# EAGLE design RC_module (EAGLE 7.2.0)
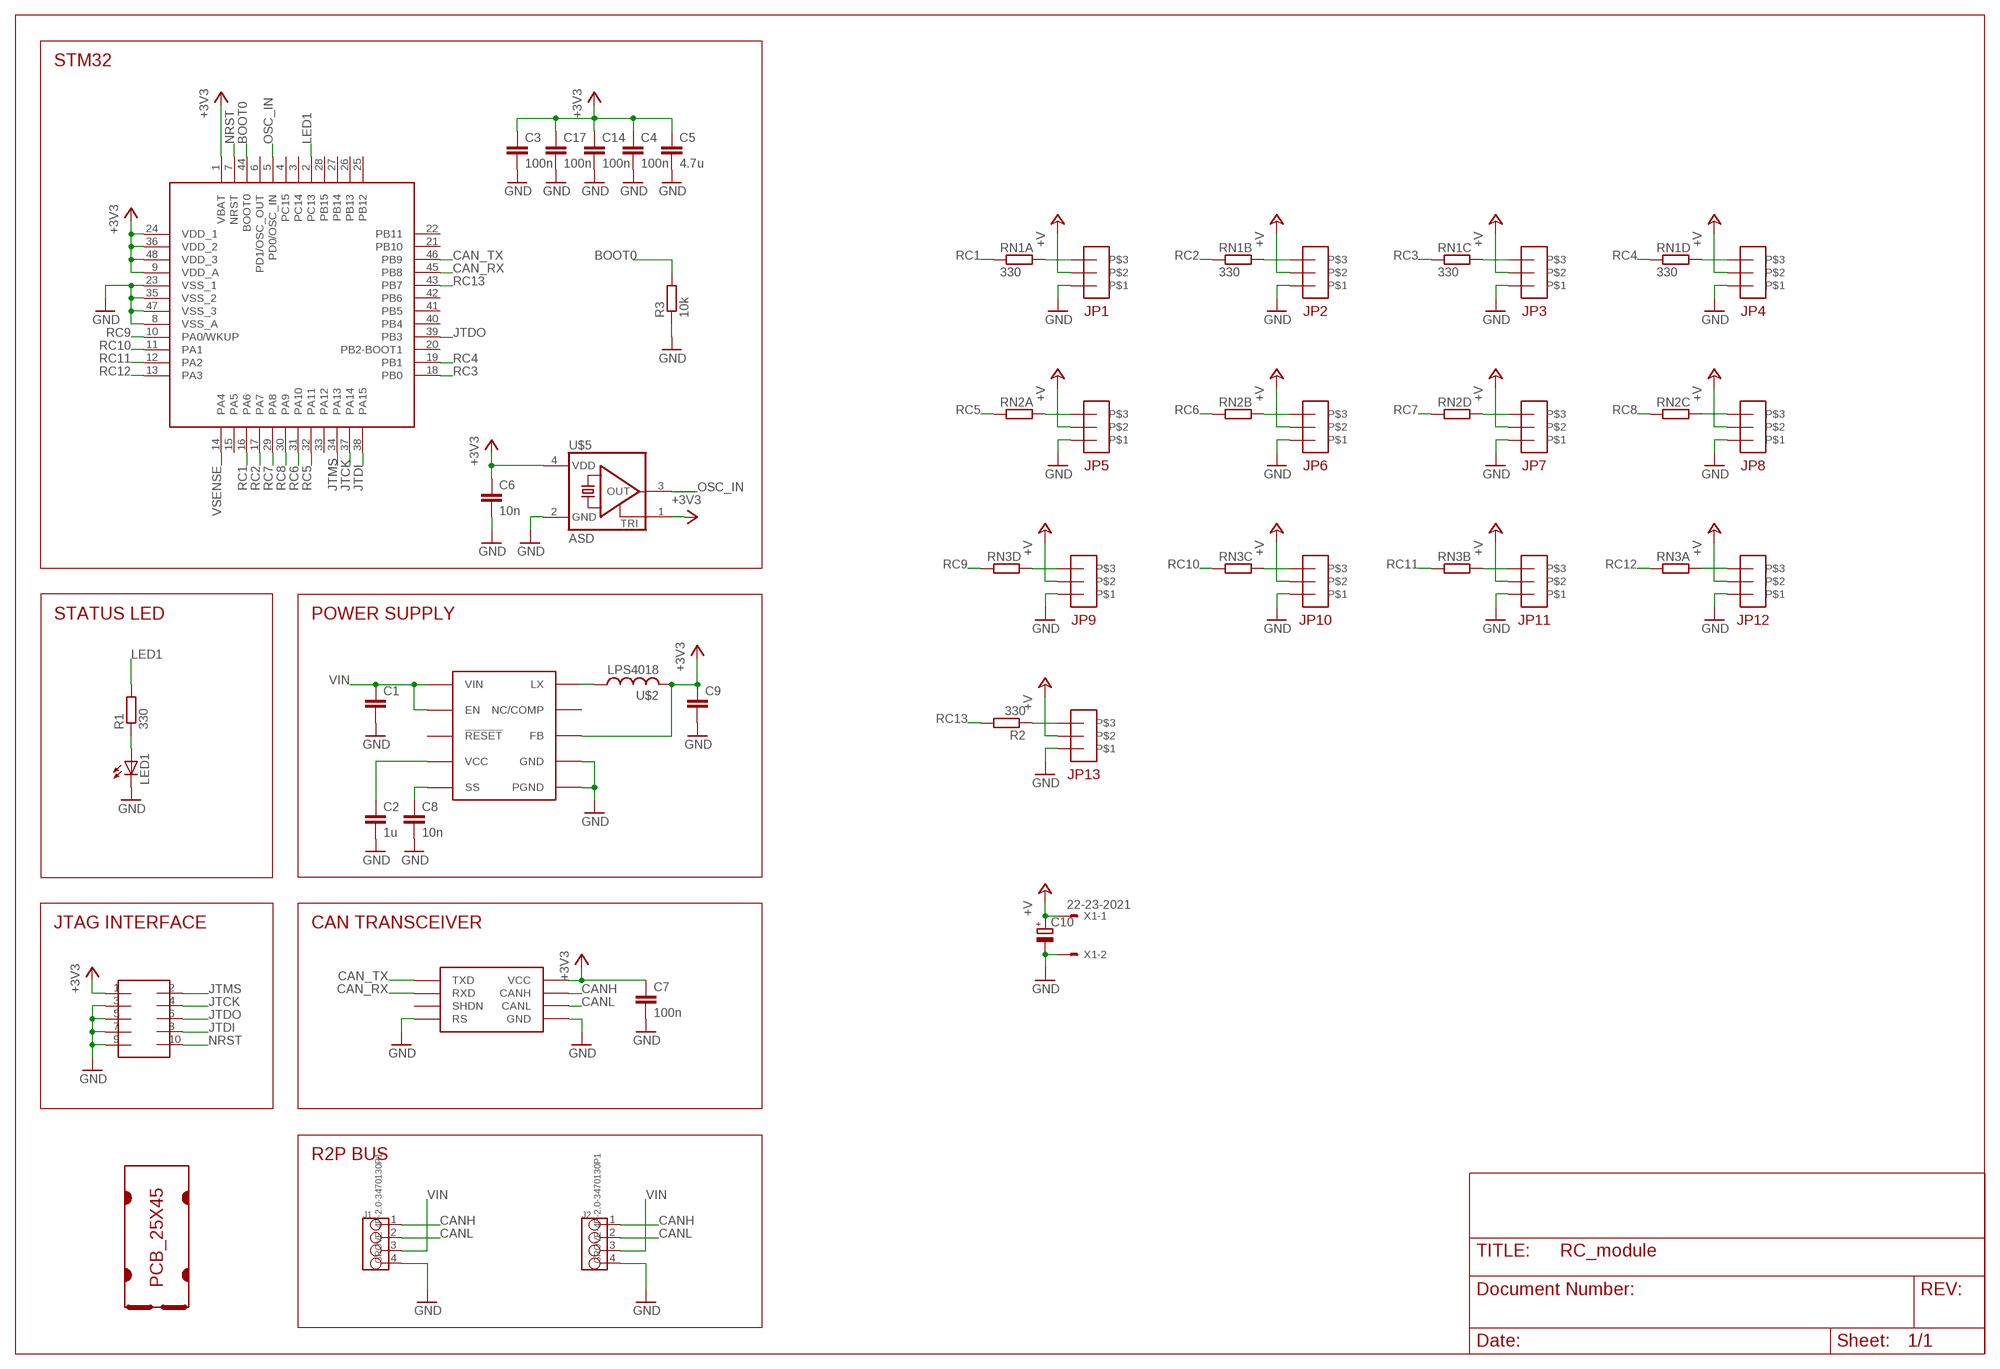
[diagram p0: schematic, sheet 1]

## Parts
C1  C-EUC1206  [C1206]
C2  1u  C-EUC0603  [C0603]
C3  100n  C-EUC0603  [C0603]
C4  100n  C-EUC0603  [C0603]
C5  4.7u  C-EUC0805  [C0805]
C6  10n  C-EUC0603  [C0603]
C7  100n  C-EUC0603  [C0603]
C8  10n  C-EUC0603  [C0603]
C9  C-EUC0805  [C0805]
C10  CPOL-EUB/3528-21R  [B/3528-21R]
C14  100n  C-EUC0603  [C0603]
C17  100n  C-EUC0603  [C0603]
J1  GROVE-4P-2.0-3470130P1  [4P-2.0]
J2  GROVE-4P-2.0-3470130P1  [4P-2.0]
JP1  PINHD-3  [1X03]
JP2  PINHD-3  [1X03]
JP3  PINHD-3  [1X03]
JP4  PINHD-3  [1X03]
JP5  PINHD-3  [1X03]
JP6  PINHD-3  [1X03]
JP7  PINHD-3  [1X03]
JP8  PINHD-3  [1X03]
JP9  PINHD-3  [1X03]
JP10  PINHD-3  [1X03]
JP11  PINHD-3  [1X03]
JP12  PINHD-3  [1X03]
JP13  PINHD-3  [1X03]
LED1  LEDCHIPLED_0805  [CHIPLED_0805]
R1  330  R-EU_R0603  [R0603]
R2  330  R-EU_R0603  [R0603]
R3  10k  R-EU_R0603  [R0603]
RN1  330  RESISTOR_ARRAY_4  [RN8P-4R-CRA06S]
RN2  RESISTOR_ARRAY_4  [RN8P-4R-CRA06S]
RN3  RESISTOR_ARRAY_4  [RN8P-4R-CRA06S]
SOT1  MAX3051EKA  [SOT23-8L]
U$1  PCB_25X45  [25X45]
U$2  LPS4018  [LPS4018]
U$3  MAX17501  [TDFN-10]
U$4  FTSH-105TH  [FTSH-105-TH]
U$5  ASD  [2.5X2]
U$6  STM32F103CX  [LQFP48]
X1  22-23-2021  [22-23-2021]

## Nets
+3V3: C3.1 C4.1 C5.1 C6.1 C7.1 C9.1 C14.1 C17.1 SOT1.3(VCC) U$2.P$2 U$3.P$5(FB) U$4.1 U$5.1(TRI) U$5.4(VDD) U$6.1(VBAT) U$6.9(VDD_A) U$6.24(VDD_1) U$6.36(VDD_2) U$6.48(VDD_3)
+V: C10.+ JP1.2 JP2.2 JP3.2 JP4.2 JP5.2 JP6.2 JP7.2 JP8.2 JP9.2 JP10.2 JP11.2 JP12.2 JP13.2 X1.1
BOOT0: R3.2 U$6.44(BOOT0)
CAN_RX: SOT1.4(RXD) U$6.45(PB8)
CAN_TX: SOT1.1(TXD) U$6.46(PB9)
CANH: J1.1 J2.1 SOT1.7(CANH)
CANL: J1.2 J2.2 SOT1.6(CANL)
GND: C1.2 C2.2 C3.2 C4.2 C5.2 C6.2 C7.2 C8.2 C9.2 C10.- C14.2 C17.2 J1.4 J2.4 JP1.1 JP2.1 JP3.1 JP4.1 JP5.1 JP6.1 JP7.1 JP8.1 JP9.1 JP10.1 JP11.1 JP12.1 JP13.1 LED1.C R3.1 SOT1.2(GND) SOT1.8(RS) U$3.P$1(PGND) U$3.P$9(GND) U$3.P$11(PGND) U$4.3 U$4.5 U$4.7 U$4.9 U$5.2(GND) U$6.8(VSS_A) U$6.23(VSS_1) U$6.35(VSS_2) U$6.47(VSS_3) X1.2
JTCK: U$4.4 U$6.37(PA14)
JTDI: U$4.8 U$6.38(PA15)
JTDO: U$4.6 U$6.39(PB3)
JTMS: U$4.2 U$6.34(PA13)
LED1: R1.2 U$6.2(PC13)
N$1: U$2.P$1 U$3.P$10(LX)
N$4: LED1.A R1.1
N$5: JP12.3 RN3.8
N$7: C2.1 U$3.P$4(VCC)
N$8: C8.1 U$3.P$6(SS)
N$9: JP6.3 RN2.7
N$10: JP7.3 RN2.5
N$11: JP5.3 RN2.8
N$12: JP1.3 RN1.8
N$13: JP9.3 RN3.5
N$14: JP10.3 RN3.6
N$15: JP11.3 RN3.7
N$16: JP13.3 R2.1
N$17: JP2.3 RN1.7
N$18: JP3.3 RN1.6
N$20: JP8.3 RN2.6
N$21: JP4.3 RN1.5
NRST: U$4.10 U$6.7(NRST)
OSC_IN: U$5.3(OUT) U$6.5(PD0/OSC_IN)
RC1: RN1.1 U$6.16(PA6)
RC2: RN1.2 U$6.17(PA7)
RC3: RN1.3 U$6.18(PB0)
RC4: RN1.4 U$6.19(PB1)
RC5: RN2.1 U$6.32(PA11)
RC6: RN2.2 U$6.31(PA10)
RC7: RN2.4 U$6.29(PA8)
RC8: RN2.3 U$6.30(PA9)
RC9: RN3.4 U$6.10(PA0/WKUP)
RC10: RN3.3 U$6.11(PA1)
RC11: RN3.2 U$6.12(PA2)
RC12: RN3.1 U$6.13(PA3)
RC13: R2.2 U$6.43(PB7)
VIN: C1.1 J1.3 J2.3 U$3.P$2(VIN) U$3.P$3(EN)
VSENSE: U$6.14(PA4)
Unconnected: SOT1.5(SHDN) U$3.P$7(NC/COMP) U$3.P$8(!RESET) U$6.3(PC14) U$6.4(PC15) U$6.6(PD1/OSC_OUT) U$6.15(PA5) U$6.20(PB2-BOOT1) U$6.21(PB10) U$6.22(PB11) U$6.25(PB12) U$6.26(PB13) U$6.27(PB14) U$6.28(PB15) U$6.33(PA12) U$6.40(PB4) U$6.41(PB5) U$6.42(PB6)

## Notes on the sheet
- STM32
- STATUS LED | POWER SUPPLY
- JTAG INTERFACE | CAN TRANSCEIVER
- R2P BUS

## Library data of the parts
C1-C9 C14 C17 = rcl:C-EU: CAPACITOR, European symbol
C10 = rcl:CPOL-EU: POLARIZED CAPACITOR, European symbol
J1 J2 = OPL Eagle Library:GROVE-4P-2.0
JP1-JP13 = connectors:PINHD-3
LED1 = led:LED: LED OSRAM: - CHIPLED LG R971, LG N971, LY N971, LG Q971, LY Q971, LO R971, LY R971 LH N974, LH R974 LS Q976, LO Q976, LY Q976 LO Q996 - Hyper CHIPLED LW Q18S LB Q993, LB Q99A, LB R99A - SideLED LS A670, LO A670, LY A670, LG A670, LP A670 LB A673, LV A673, LT A673, LW A673 LH A674 LY A675 LS A676, LA A676, LO A676, LY A676, LW A676 LS A679, LY A679, LG A679 - Hyper Micro SIDELED® LS Y876, LA Y876, LO Y876, LY Y876 LT Y87S - SmartLED LW L88C, LW L88S LB L89C, LB L89S, LG L890 LS L89K, LO L89K, LY L89K LS L896, LA L896, LO L896, LY L896 - TOPLED LS T670, LO T670, LY T670, LG T670, LP T670 LSG T670, LSP T670, LSY T670, LOP T670, LYG T670 LG T671, LOG T671, LSG T671 LB T673, LV T673, LT T673, LW T673 LH T674 LS T676, LA T676, LO T676, LY T676, LB T676, LH T676, LSB T676, LW T676 LB T67C, LV T67C, LT T67C, LS T67K, LO T67K, LY T67K, LW E67C LS E67B, LA E67B, LO E67B, LY E67B, LB E67C, LV E67C, LT E67C LW T67C LS T679, LY T679, LG T679 LS T770, LO T770, LY T770, LG T770, LP T770 LB T773, LV T773, LT T773, LW T773 LH T774 LS E675, LA E675, LY E675, LS T675 LS T776, LA T776, LO T776, LY T776, LB T776 LHGB T686 LT T68C, LB T68C - Hyper Mini TOPLED® LB M676 - Mini TOPLED Santana® LG M470 LS M47K, LO M47K, LY M47K Source: http://www.osram.convergy.de LUXEON: - LUMILED® LXK2-PW12-R00, LXK2-PW12-S00, LXK2-PW14-U00, LXK2-PW14-V00 LXK2-PM12-R00, LXK2-PM12-S00, LXK2-PM14-U00 LXK2-PE12-Q00, LXK2-PE12-R00, LXK2-PE12-S00, LXK2-PE14-T00, LXK2-PE14-U00 LXK2-PB12-K00, LXK2-PB12-L00, LXK2-PB12-M00, LXK2-PB14-N00, LXK2-PB14-P00, LXK2-PB14-Q00 LXK2-PR12-L00, LXK2-PR12-M00, LXK2-PR14-Q00, LXK2-PR14-R00 LXK2-PD12-Q00, LXK2-PD12-R00, LXK2-PD12-S00 LXK2-PH12-R00, LXK2-PH12-S00 LXK2-PL12-P00, LXK2-PL12-Q00, LXK2-PL12-R00 Source: www.luxeon.com KINGBRIGHT: KA-3528ASYC Source: www.kingbright.com
R1-R3 = rcl:R-EU_: RESISTOR, European symbol
RN1-RN3 = dp_devices:RESISTOR_ARRAY_4: 4 Resistor Array 0603
SOT1 = maxim:MAX3051
U$1 = r2p_pcb:PCB_25X45
U$2 = coilcraft:LPS4018
U$3 = maxim:MAX17501
U$4 = samtec:FTSH-105
U$5 = abracon:ASD
U$6 = st:STM32F103CX
X1 = con-molex:22-23-2021: .100" (2.54mm) Center Header - 2 Pin; MF: MOLEX; MPN: 22-23-2021; OC_FARNELL: 1462926; OC_NEWARK: 25C3832

## Board
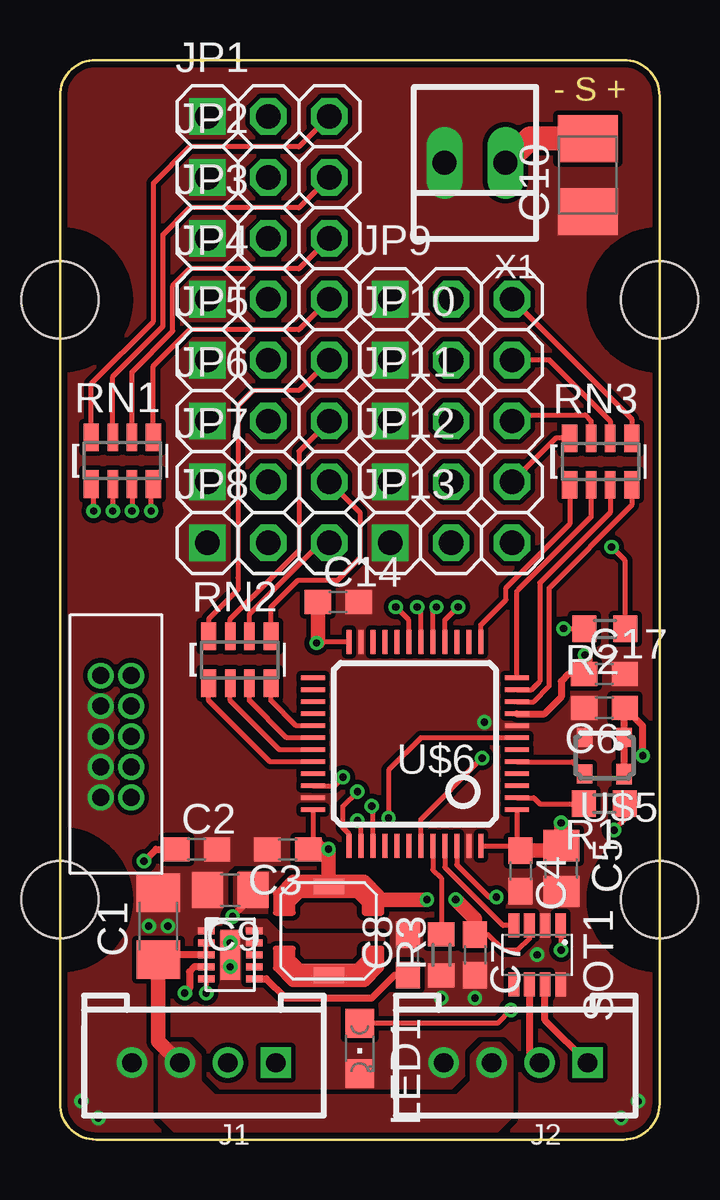
[diagram p1: board, top side]
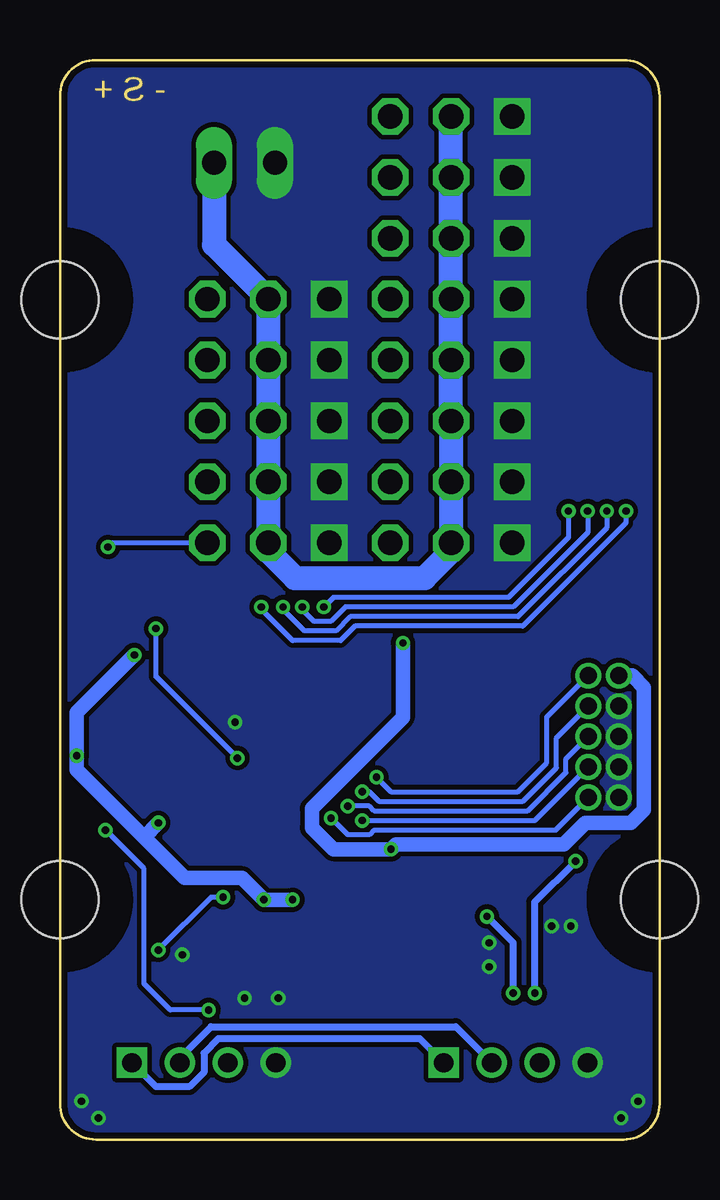
[diagram p2: board, bottom side, seen from below]

Size 25 x 45 mm. Coordinates in mm from the lower left corner, seen from the top.
Copper layers (1*16): Top 0.035mm / dielectric 1.5mm / Bottom 0.035mm
Design rules "ITead_rule-8mil *": minimum track width 0.2mm, minimum drill 0.3mm, track to track 0.2mm, track to pad 0.2mm, pad to pad 0.2mm, via to via 0.2mm, smd to smd 0mil, copper to edge 10mil, drill to drill 10mil, minimum pad ring 0.15mm, minimum via ring 0.15mm, stop-mask expansion 2mil, vias tented up to drill 100mil, thermal gap 10mil
tRestrict: 2 lines

### Footprints (pad centres in the part's own frame; a part is rotated, then mirrored left to right if it is on the bottom)
C1206 = smd 1.6 x 1.8: 1 -1.4,0; 2 1.4,0
C0603 = smd 1.1 x 1: 1 -0.85,0; 2 0.85,0
C0805 = smd 1.3 x 1.5: 1 -0.95,0; 2 0.95,0
B/3528-21R = smd 1.95 x 2.5: + 1.525,0; - -1.525,0
4P-2.0 = drill 0.8 pad 1.27 square: 1 -3,0 | drill 0.8 pad 1.27: 2 -1,0; 3 1,0; 4 3,0
1X03 = drill 1.016 square: 1 -2.54,0 | drill 1.016 octagon: 2 0,0; 3 2.54,0
CHIPLED_0805 = smd 1.2 x 1.2: A 0,-1.05; C 0,1.05
R0603 = smd 1 x 1.1: 1 -0.85,0; 2 0.85,0
RN8P-4R-CRA06S = smd 0.63 x 1.15: 1 -1.295,-0.975; 4 1.295,-0.975; 5 1.295,0.975; 8 -1.295,0.975 | smd 0.44 x 1.15: 2 -0.4,-0.975; 3 0.4,-0.975; 6 0.4,0.975; 7 -0.4,0.975
SOT23-8L = smd 0.45 x 1: 1 -0.975,-1.225; 2 -0.325,-1.225; 3 0.325,-1.225; 4 0.975,-1.225; 5 0.975,1.225; 6 0.325,1.225; 7 -0.325,1.225; 8 -0.975,1.225
25X45 = hole 3.2: 0,10; 25,10; 0,35; 25,35
LPS4018 = smd 0.635 x 1.27: P$1 -1.85,0; P$2 1.85,0
TDFN-10 = smd 0.7 x 0.3: P$1 -1,1; P$2 -1,0.5; P$3 -1,0; P$4 -1,-0.5; P$5 -1,-1; P$6 1,-1; P$7 1,-0.5; P$8 1,0; P$9 1,0.5; P$10 1,1 | smd 0.8 x 2.08: P$11 0,0
FTSH-105-TH = drill 0.711 pad 1.016: 1 -2.54,0; 2 -2.54,1.27; 3 -1.27,0; 4 -1.27,1.27; 5 0,0; 6 0,1.27; 7 1.27,0; 8 1.27,1.27; 9 2.54,0; 10 2.54,1.27
2.5X2 = smd 0.65 x 0.8: 1 -0.825,-0.762; 2 0.825,-0.762; 3 0.825,0.762 | smd 0.65 x 0.85: 4 -0.825,0.762
LQFP48 = smd 1 x 0.2: 1 -4.25,2.75; 2 -4.25,2.25; 3 -4.25,1.75; 4 -4.25,1.25; 5 -4.25,0.75; 6 -4.25,0.25; 7 -4.25,-0.25; 8 -4.25,-0.75; 9 -4.25,-1.25; 10 -4.25,-1.75; 11 -4.25,-2.25; 12 -4.25,-2.75; 25 4.25,-2.75; 26 4.25,-2.25; 27 4.25,-1.75; 28 4.25,-1.25; 29 4.25,-0.75; 30 4.25,-0.25; 31 4.25,0.25; 32 4.25,0.75; 33 4.25,1.25; 34 4.25,1.75; 35 4.25,2.25; 36 4.25,2.75 | smd 0.2 x 1: 13 -2.75,-4.25; 14 -2.25,-4.25; 15 -1.75,-4.25; 16 -1.25,-4.25; 17 -0.75,-4.25; 18 -0.25,-4.25; 19 0.25,-4.25; 20 0.75,-4.25; 21 1.25,-4.25; 22 1.75,-4.25; 23 2.25,-4.25; 24 2.75,-4.25; 37 2.75,4.25; 38 2.25,4.25; 39 1.75,4.25; 40 1.25,4.25; 41 0.75,4.25; 42 0.25,4.25; 43 -0.25,4.25; 44 -0.75,4.25; 45 -1.25,4.25; 46 -1.75,4.25; 47 -2.25,4.25; 48 -2.75,4.25
22-23-2021 = drill 1 long: 1 -1.27,0; 2 1.27,0

### Placement (x,y rotation side)
C1  4.1,8.9 90 top
C2  5.7,12.1 0 top
C3  9.5,12.1 180 top
C4  19.2,11.2 270 top
C5  20.9,11.3 270 top
C6  22.7,18 180 top
C7  17.3,7.7 270 top
C8  14.5,7.7 90 top
C9  7.1,10.4 180 top
C10  22,40.2 90 top
C14  11.6,22.4 0 top
C17  22.7,19.4 0 top
J1  6,3.2 180 top
J2  19,3.2 180 top
JP1  8.69,42.65 0 top
JP2  8.69,40.11 0 top
JP3  8.69,37.57 0 top
JP4  8.69,35.03 0 top
JP5  8.69,32.49 0 top
JP6  8.69,29.95 0 top
JP7  8.69,27.41 0 top
JP8  8.69,24.87 0 top
JP9  16.31,35.03 0 top
JP10  16.31,32.49 0 top
JP11  16.31,29.95 0 top
JP12  16.31,27.41 0 top
JP13  16.31,24.87 0 top
LED1  12.5,3.8 180 top
R1  22.7,14 180 top
R2  22.71,21.29 180 top
R3  15.9,7.7 90 top
RN1  2.6,28.3 0 top
RN2  7.5,20 0 top
RN3  22.55,28.26 0 top
SOT1  19.9,7.7 180 top
U$1  0,0 0 top
U$2  11.2,8.7 90 top
U$3  7.1,7.7 0 top
U$4  1.7,16.8 270 top
U$5  22.7,16 180 top
U$6  14.8,16.5 180 top
X1  17.31,40.71 180 top

### Tracks (layer width: path | path; a pad name or v marks a point on that pad's centre or on a via)
+3V3  (via drill 0.3)
  Top 0.2: U$3.P$5 v6.1,6.1 | C7.1 17.85,8.55 18.5,7.9 19.1,7.9 19.57,8.38 SOT1.3 | U$6.36 10.55,12.3 C3.1 | U$6.48 19,12.25 C4.1 19.05,12.2 U$6.1 | U$6.24 10.75,20.75 v10.7,20.7
  Top 0.3: 8.05,10.55 8.05,10.75 7.95,10.75 | U$6.9 20.2,17.75 20.9,18.45 20.9,19.1 21.2,19.4 C17.1 | C6.1 23.52,17.98 | v24.3,16 24.3,17.25 C6.1 | v7.2,9.3 8.05,10.15 C9.1 | U$5.4 U$5.1 23.52,17.98 | 23.52,17.98 C6.1
  Top 0.6: U$2.P$2 v11.2,12.1 C3.1 | 10.55,12.3 10.7,12.3 | C4.1 20.7,12.05 C5.1 20.9,13.1 v20.9,13.2 | C7.1 17.3,9.2 v16.5,10 | 21.8,19.45 C17.1 21.9,19.45 v21.9,20.2 | v15.3,10 13,10 | C14.1 10.75,20.75 v10.7,20.7
  Bottom 0.3: v6.1,6.1 6.1,8.2 v7.2,9.3
  Bottom 0.6: v15.3,10 v16.5,10 17.4,10.9 19.8,10.9 21.5,12.6 | v20.9,13.2 21.5,12.6 | 21.5,12.6 24.3,15.4 v24.3,16 24.3,17.8 v21.9,20.2 | U$4.1 1.14,19.34 1.1,19.3 0.65,18.85 0.65,13.75 1.2,13.2 3.1,13.2 4,12.3 11,12.3 v11.2,12.1 13.6,12.1 14.5,13 14.5,13.8 10.7,17.6 v10.7,20.7
  pour Top (rank 5, no thermals): 13.3,8.9 13.5,9.1 13.5,10.3 12.8,11 9.5,11 9.4,11.1 7.5,11.1 7.3,10.9 7.3,9.8 8.3,8.9
+V
  Top 1: C10.+ 19.59,41.73 X1.1
  Bottom 1: JP1.2 JP2.2 JP3.2 JP4.2 JP5.2 JP6.2 JP7.2 JP8.2 8.69,24.51 9.8,23.4 15.2,23.4 16.31,24.51 JP13.2 JP12.2 JP11.2 JP10.2 JP9.2 18.58,37.3 X1.1
BOOT0
  Top 0.2: U$6.44 15.55,11.25 15.9,10.9 R3.2
CAN_RX
  Top 0.2: U$6.45 16.05,11.35 18.4,9 18.48,8.93 SOT1.4
CAN_TX  (via drill 0.3)
  Top 0.2: U$6.46 16.55,11.45 17.9,10.1 v18.2,10.1 | SOT1.1 20.88,7.92 v20.9,7.9
  Bottom 0.2: v18.2,10.1 18.7,10.1 v20.9,7.9
CANH
  Top 0.3: J2.1 20.23,4.97 SOT1.7
  Bottom 0.3: J1.1 10,4.2 18.4,4.2 19,3.6 19,2.8 19.6,2.2 21,2.2 J2.1
CANL
  Top 0.3: 19.57,3.62 J2.2 19.57,3.62 | SOT1.6 19.57,3.62
  Bottom 0.3: J1.2 8.5,4.7 18.7,4.7 20,3.4 J2.2
GND  (via drill 0.3)
  other vias: 7.1,8.2 7.1,7.2 4.5,8.9 3.7,8.9 15.9,5.9 17.3,5.9 19.9,7.7 24.1,1.6 23.4,0.9 1.6,0.9 0.9,1.6 17.7,17.4
  pour Bottom (no thermals): 0,0 25,0 25,45 0,45
  pour Top (rank 6, no thermals): 0,0 25,0 25,45 0,45
JTCK  (via drill 0.3)
  Top 0.2: U$6.37 12.05,12.75 11.8,13 11.8,13.9 v12.4,14.5
  Bottom 0.2: v12.4,14.5 12.1,14.5 11.7,14.1 5.7,14.1 4.3,15.5 4.3,16.74 U$4.4
JTDI  (via drill 0.3)
  Top 0.2: U$6.38 12.55,13.15 v12.4,13.3
  Bottom 0.2: v12.4,13.3 5.2,13.3 U$4.8
JTDO  (via drill 0.3)
  Top 0.2: U$6.39 13.05,13.85 v13,13.9
  Bottom 0.2: v13,13.9 12.1,13.9 11.9,13.7 5.5,13.7 3.9,15.3 3.9,15.87 U$4.6
JTMS  (via drill 0.3)
  Top 0.2: U$6.34 11.45,14.75 v11.8,15.1
  Bottom 0.2: v11.8,15.1 11.2,14.5 5.9,14.5 4.7,15.7 4.7,17.61 U$4.2
LED1
  Top 0.2: U$6.2 19.75,14.25 20,14 R1.2
N$1
  pour Top (no thermals): 7.8,8.7 8.2,8.7 8.5,8.2 8.5,7.5 9.6,6.4 12.8,6.4 13.5,7.1 13.5,8.3 13.3,8.5 9.2,8.5 8.6,9.1 7.8,9.1
N$4  (via drill 0.3)
  Top 0.2: R1.1 23.55,13.35 v23.1,12.9 | v18.8,5.4 18.25,4.85 LED1.A
  Bottom 0.2: v18.8,5.4 20.4,5.4 21.5,6.5 21.5,11.3 v23.1,12.9
N$5
  Top 0.2: RN3.8 20.68,29.23 JP12.3
N$7  (via drill 0.3)
  Top 0.3: U$3.P$4 5.6,7.2 5.4,7 5.4,6.3 v5.2,6.1 | v3.5,11.6 4,12.1 C2.1
  Bottom 0.3: v5.2,6.1 5.2,9.9 v3.5,11.6
N$8
  Top 0.3: U$3.P$6 8.6,6.7 9.4,5.9 13,5.9 13.95,6.85 C8.1
N$9
  Top 0.2: JP6.3 9.96,28.68 9.96,24.56 9,23.6 7.1,21.7 RN2.7
N$10
  Top 0.2: JP7.3 12.5,26.14 12.5,24.23 11.56,23.3 9.9,23.3 8.79,22.2 RN2.5
N$11
  Top 0.2: JP5.3 9.96,31.22 8.05,31.22 7.42,30.59 7.42,24.23 7.42,23.42 7.42,22.92 6.2,21.7 RN2.8
N$12
  Top 0.2: JP1.3 9.96,41.38 5.42,41.38 3.9,39.87 3.9,34.1 1.3,31.5 RN1.8
N$13
  Top 0.2: JP9.3 23.84,30.04 RN3.5
N$14
  Top 0.2: RN3.6 22.95,29.95 20.41,32.49 JP10.3
N$15
  Top 0.2: JP11.3 19.1,30.2 21.5,30.2 21.9,30.2 22.14,29.95 RN3.7
N$16  (via drill 0.3)
  Top 0.2: R2.1 23.57,24.14 v23,24.7
  Bottom 0.2: JP13.3 22.83,24.87 v23,24.7
N$17
  Top 0.2: JP2.3 9.96,38.84 5.42,38.84 4.3,37.73 4.3,33.9 2.2,31.8 RN1.7
N$18
  Top 0.2: JP3.3 9.96,36.3 5.42,36.3 4.7,35.59 4.7,33.7 3,32 RN1.6
N$20
  Top 0.2: JP8.3 10.87,24.87 9.1,23.1 7.9,21.9 RN2.6
N$21
  Top 0.2: JP4.3 9.96,33.76 5.42,33.76 3.9,32.24 RN1.5
NRST  (via drill 0.3)
  Top 0.2: U$6.7 15.05,16.75 13.7,15.4 v13.7,13.4
  Bottom 0.2: v13.7,13.4 13,12.7 12.7,12.7 12.1,12.7 11.9,12.9 4.33,12.9 U$4.10
OSC_IN
  Top 0.2: U$6.5 21.36,15.75 U$5.3
RC1  (via drill 0.3)
  Top 0.2: v1.4,26.2 1.4,27.23 RN1.1 | U$6.16 16.05,21.65 v16.6,22.2
  Bottom 0.2: v1.4,26.2 1.4,25.7 5.7,21.4 12.7,21.4 13.3,20.8 15.3,20.8 16.6,22.1 v16.6,22.2
RC2  (via drill 0.3)
  Top 0.2: RN1.2 v2.2,26.2 | U$6.17 15.55,22.05 v15.7,22.2
  Bottom 0.2: v2.2,26.2 2.2,25.5 5.9,21.8 12.9,21.8 13.5,21.2 14.8,21.2 15.7,22.1 v15.7,22.2
RC3  (via drill 0.3)
  Top 0.2: RN1.3 v3,26.2 | U$6.18 15.05,22.05 v14.9,22.2
  Bottom 0.2: v3,26.2 3,25.3 6.1,22.2 13.1,22.2 13.7,21.6 14.4,21.6 14.9,22.1 v14.9,22.2
RC4  (via drill 0.3)
  Top 0.2: v3.8,26.2 3.8,27.23 RN1.4 | U$6.19 14.55,21.65 v14,22.2
  Bottom 0.2: v3.8,26.2 3.8,25.1 6.3,22.6 13.6,22.6 v14,22.2
RC5
  Top 0.2: U$6.32 8.75,15.75 6.2,18.3 RN2.1
RC6
  Top 0.2: U$6.31 9.15,16.25 7.1,18.3 RN2.2
RC7
  Top 0.2: U$6.29 9.85,17.25 8.8,18.3 RN2.4
RC8
  Top 0.2: U$6.30 9.45,16.75 7.9,18.3 RN2.3
RC9
  Top 0.2: U$6.10 19.75,18.25 20.4,18.9 20.4,23 23.8,26.4 23.84,26.44 RN3.4
RC10
  Top 0.2: RN3.3 22.95,26.14 20,23.2 20,19.1 19.65,18.75 U$6.11
RC11
  Top 0.2: RN3.2 22.14,25.95 19.1,22.9 19.05,22.85 U$6.12
RC12
  Top 0.2: RN3.1 21.25,25.65 18.6,23 18.6,22.5 17.55,21.45 U$6.13
RC13  (via drill 0.3)
  Top 0.2: R2.2 21.02,21.29 v21,21.3 | U$6.43 15.05,13.35 v17.6,15.9
  Bottom 0.2: v17.6,15.9 21,19.3 v21,21.3
VIN
  Top 0.2: U$3.P$3 U$3.P$2
  Top 0.3: U$3.P$3 4.3,7.7 C1.1
  Top 0.6: C1.1 4.1,4.1 J1.3
  pour Top (no thermals): 4.7,4 5.3,4 5.8,3.5 5.8,2.4 6.4,1.8 16.6,1.8 17.2,2.4 17.2,3.5 17.7,4 18.3,4 18.8,3.5 18.8,1 17.8,0 5.2,0 4.2,1 4.2,3.5

### Text on the board
Dimension: - S +
200bmp: RC module / v1.1 (2014/12)